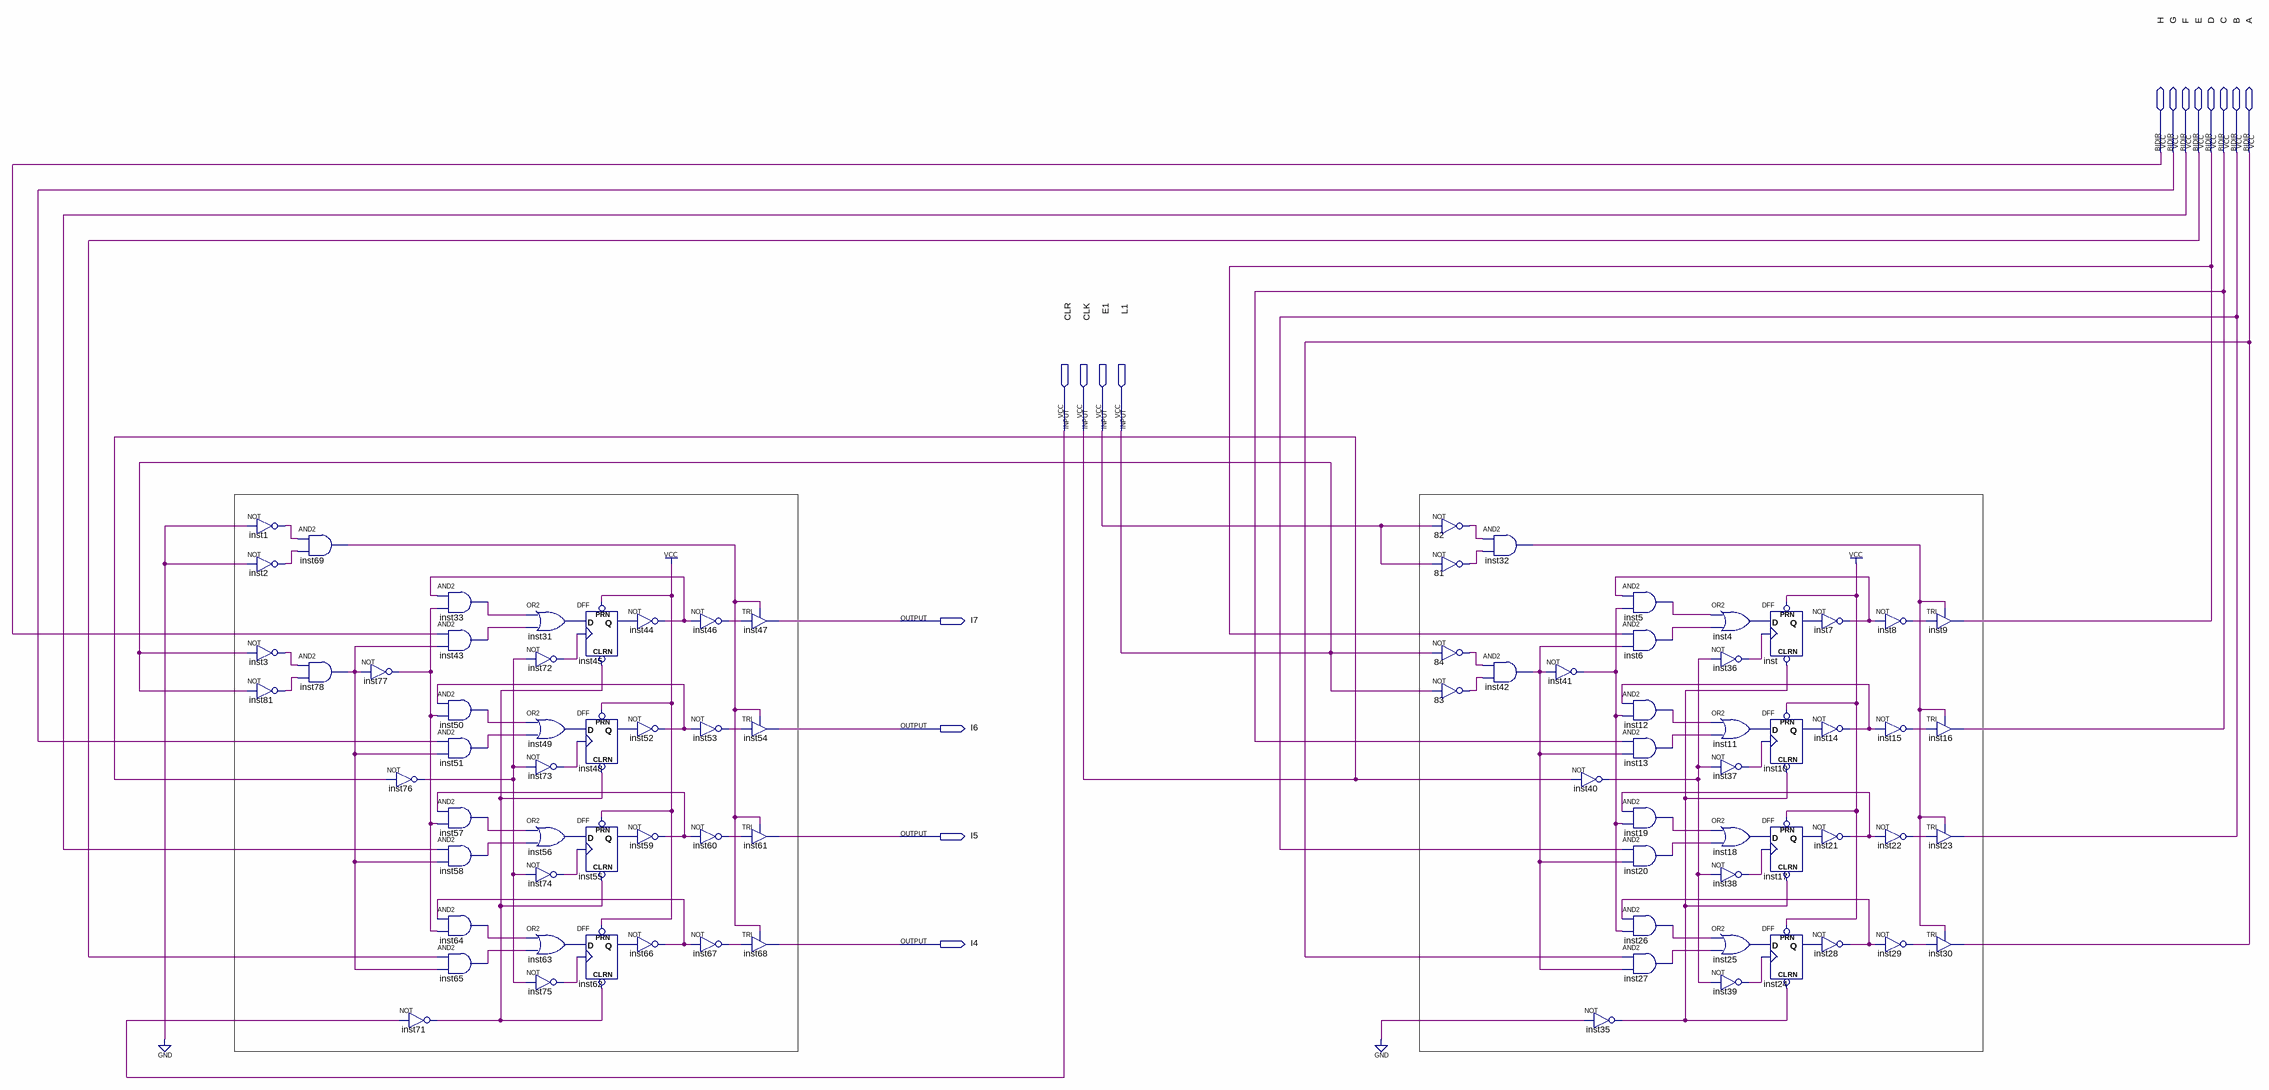
[diagram p0: schematic sheet]
// Quartus schematic instruction_register.bdf as structural Verilog: 82 symbols, 16 pins
module instruction_register (
  input  CLR,
  input  CLK,
  input  E1,
  input  L1,
  inout  H,
  inout  G,
  inout  F,
  inout  E,
  inout  D,
  inout  C,
  inout  B,
  inout  A,
  output I7,
  output I6,
  output I5,
  output I4
);

  wire inst1_out, inst2_out, inst3_out, inst4_out, inst5_out, inst6_out, inst7_out, inst8_out, inst10_q,
       inst11_out, inst12_out, inst13_out, inst14_out, inst15_out, inst17_q, inst18_out, inst19_out,
       inst20_out, inst21_out, inst22_out, inst24_q, inst25_out, inst26_out, inst27_out, inst28_out,
       inst29_out, inst31_out, inst32_out, inst33_out, inst35_out, inst36_out, inst37_out, inst38_out,
       inst39_out, inst40_out, inst41_out, inst42_out, inst43_out, inst44_out, inst45_q, inst46_out,
       inst48_q, inst49_out, inst50_out, inst51_out, inst52_out, inst53_out, inst55_q, inst56_out,
       inst57_out, inst58_out, inst59_out, inst60_out, inst62_q, inst63_out, inst64_out, inst65_out,
       inst66_out, inst67_out, inst69_out, inst71_out, inst72_out, inst73_out, inst74_out, inst75_out,
       inst76_out, inst77_out, inst78_out, inst81_out, inst_q, n81_out, n82_out, n83_out, n84_out;

  not inst1 (inst1_out, 1'b0);
  not inst2 (inst2_out, 1'b0);
  not inst3 (inst3_out, L1);
  not inst81 (inst81_out, L1);
  and inst69 (inst69_out, inst1_out, inst2_out);
  and inst78 (inst78_out, inst3_out, inst81_out);
  not inst77 (inst77_out, inst78_out);
  not inst76 (inst76_out, CLK);
  not inst71 (inst71_out, CLR);
  and inst33 (inst33_out, inst44_out, inst77_out);
  and inst43 (inst43_out, H, inst78_out);
  and inst50 (inst50_out, inst52_out, inst77_out);
  and inst51 (inst51_out, G, inst78_out);
  and inst57 (inst57_out, inst59_out, inst77_out);
  and inst58 (inst58_out, F, inst78_out);
  and inst64 (inst64_out, inst66_out, inst77_out);
  and inst65 (inst65_out, E, inst78_out);
  or inst31 (inst31_out, inst33_out, inst43_out);
  not inst72 (inst72_out, inst76_out);
  or inst49 (inst49_out, inst50_out, inst51_out);
  not inst73 (inst73_out, inst76_out);
  or inst56 (inst56_out, inst57_out, inst58_out);
  not inst74 (inst74_out, inst76_out);
  or inst63 (inst63_out, inst64_out, inst65_out);
  not inst75 (inst75_out, inst76_out);
  DFF inst45 (.CLRN(inst71_out), .CLK(inst72_out), .D(inst31_out), .PRN(1'b1), .Q(inst45_q));
  DFF inst48 (.CLRN(inst71_out), .CLK(inst73_out), .D(inst49_out), .PRN(1'b1), .Q(inst48_q));
  DFF inst55 (.CLRN(inst71_out), .CLK(inst74_out), .D(inst56_out), .PRN(1'b1), .Q(inst55_q));
  DFF inst62 (.CLRN(inst71_out), .CLK(inst75_out), .D(inst63_out), .PRN(1'b1), .Q(inst62_q));
  not inst44 (inst44_out, inst45_q);
  not inst52 (inst52_out, inst48_q);
  not inst59 (inst59_out, inst55_q);
  not inst66 (inst66_out, inst62_q);
  not inst46 (inst46_out, inst44_out);
  not inst53 (inst53_out, inst52_out);
  not inst60 (inst60_out, inst59_out);
  not inst67 (inst67_out, inst66_out);
  TRI inst47 (.IN(inst46_out), .OE(inst69_out), .OUT(I7));
  TRI inst54 (.IN(inst53_out), .OE(inst69_out), .OUT(I6));
  TRI inst61 (.IN(inst60_out), .OE(inst69_out), .OUT(I5));
  TRI inst68 (.IN(inst67_out), .OE(inst69_out), .OUT(I4));
  not u_82 (n82_out, E1);
  not u_81 (n81_out, E1);
  not u_84 (n84_out, L1);
  not u_83 (n83_out, L1);
  and inst32 (inst32_out, n82_out, n81_out);
  and inst42 (inst42_out, n84_out, n83_out);
  not inst41 (inst41_out, inst42_out);
  not inst40 (inst40_out, CLK);
  not inst35 (inst35_out, 1'b0);
  and inst5 (inst5_out, inst7_out, inst41_out);
  and inst6 (inst6_out, D, inst42_out);
  and inst12 (inst12_out, inst14_out, inst41_out);
  and inst13 (inst13_out, C, inst42_out);
  and inst19 (inst19_out, inst21_out, inst41_out);
  and inst20 (inst20_out, B, inst42_out);
  and inst26 (inst26_out, inst28_out, inst41_out);
  and inst27 (inst27_out, A, inst42_out);
  or inst4 (inst4_out, inst5_out, inst6_out);
  not inst36 (inst36_out, inst40_out);
  or inst11 (inst11_out, inst12_out, inst13_out);
  not inst37 (inst37_out, inst40_out);
  or inst18 (inst18_out, inst19_out, inst20_out);
  not inst38 (inst38_out, inst40_out);
  or inst25 (inst25_out, inst26_out, inst27_out);
  not inst39 (inst39_out, inst40_out);
  DFF inst (.CLRN(inst35_out), .CLK(inst36_out), .D(inst4_out), .PRN(1'b1), .Q(inst_q));
  DFF inst10 (.CLRN(inst35_out), .CLK(inst37_out), .D(inst11_out), .PRN(1'b1), .Q(inst10_q));
  DFF inst17 (.CLRN(inst35_out), .CLK(inst38_out), .D(inst18_out), .PRN(1'b1), .Q(inst17_q));
  DFF inst24 (.CLRN(inst35_out), .CLK(inst39_out), .D(inst25_out), .PRN(1'b1), .Q(inst24_q));
  not inst7 (inst7_out, inst_q);
  not inst14 (inst14_out, inst10_q);
  not inst21 (inst21_out, inst17_q);
  not inst28 (inst28_out, inst24_q);
  not inst8 (inst8_out, inst7_out);
  not inst15 (inst15_out, inst14_out);
  not inst22 (inst22_out, inst21_out);
  not inst29 (inst29_out, inst28_out);
  TRI inst9 (.IN(inst8_out), .OE(inst32_out), .OUT(D));
  TRI inst16 (.IN(inst15_out), .OE(inst32_out), .OUT(C));
  TRI inst23 (.IN(inst22_out), .OE(inst32_out), .OUT(B));
  TRI inst30 (.IN(inst29_out), .OE(inst32_out), .OUT(A));
endmodule
